# EAGLE schematic prototype_total_schematic_2355 (EAGLE 8.4.1)

## Sheet 1 of 2: Peripherals
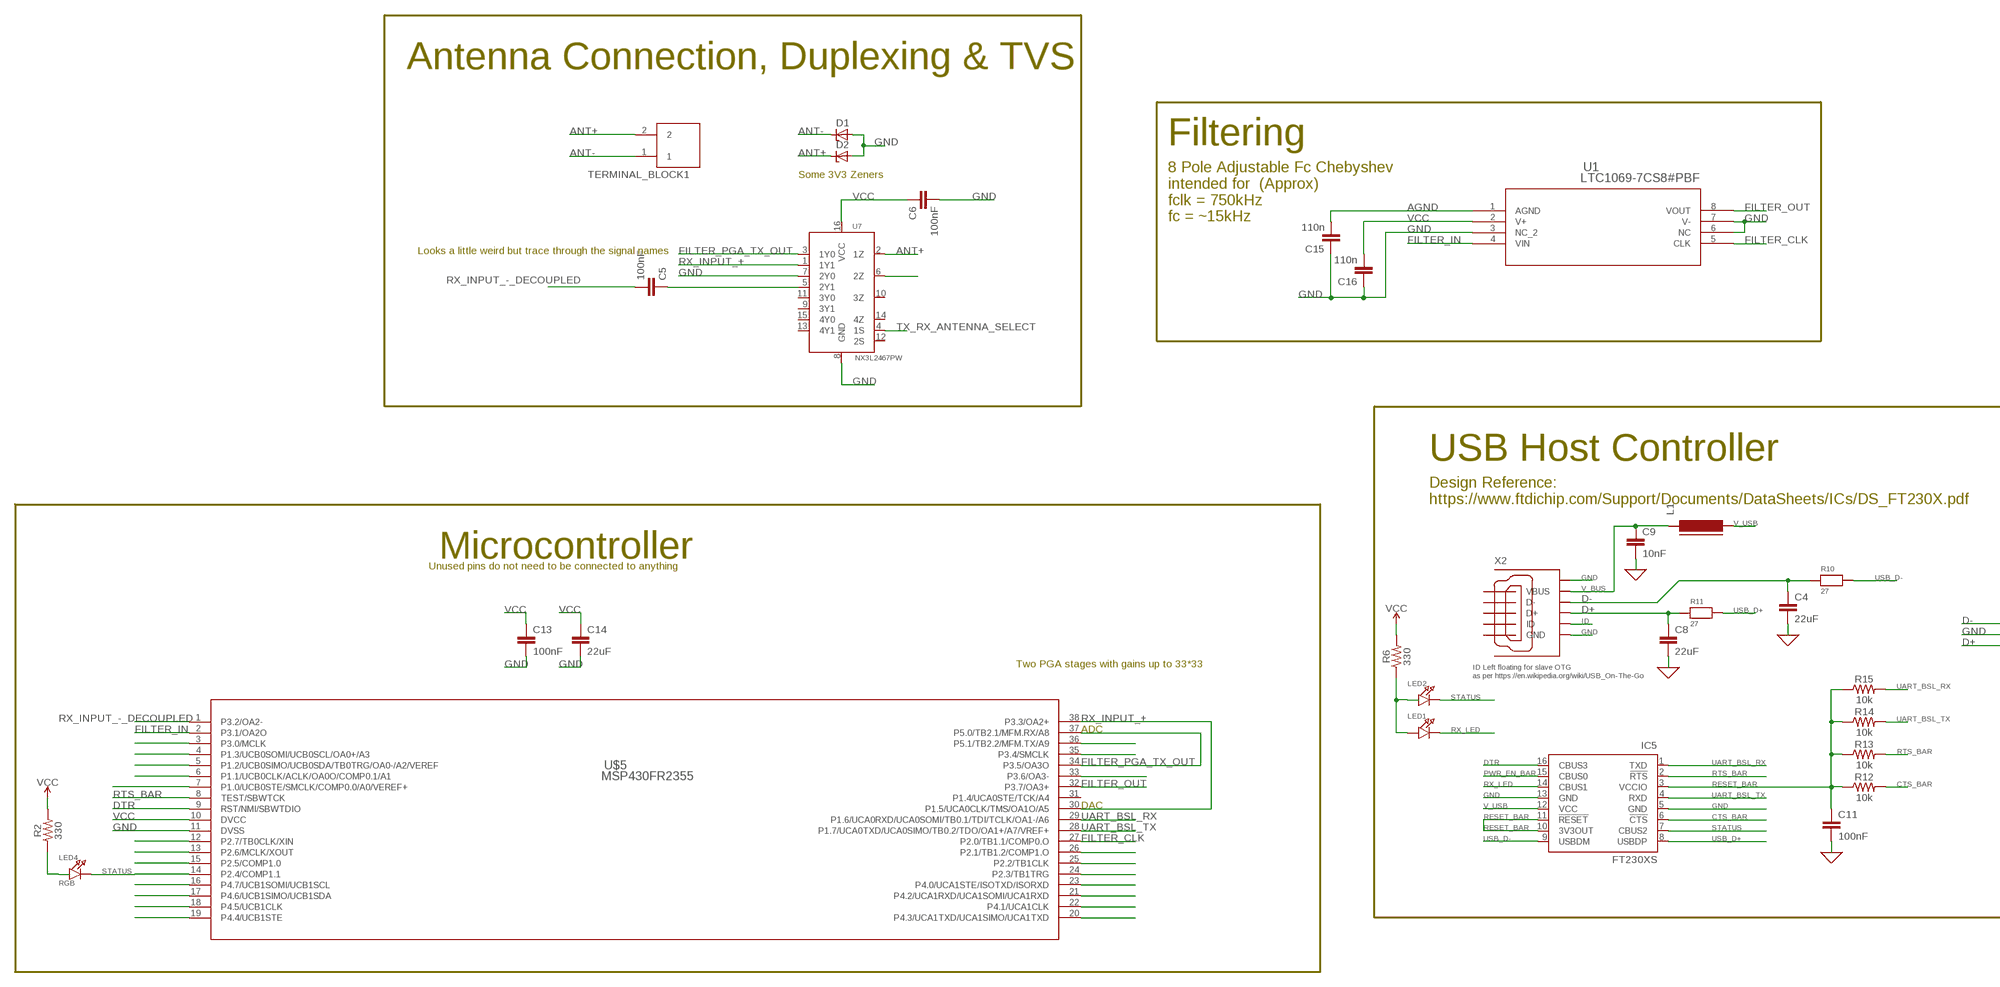
[diagram p0: schematic, sheet 1, part 1 of 2]
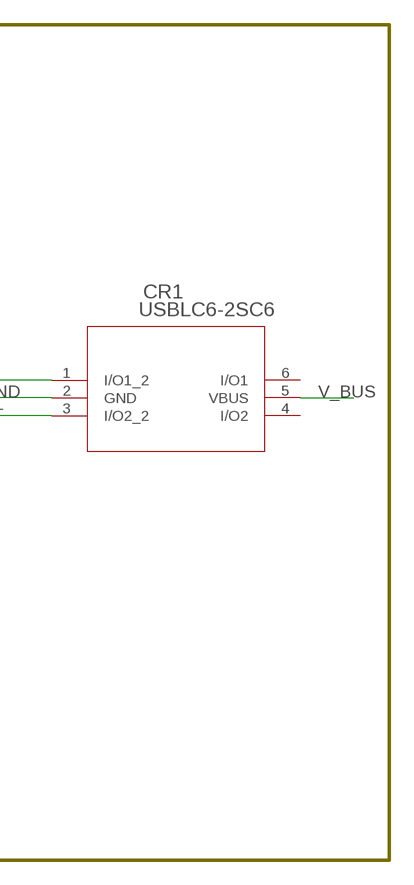
[diagram p1: schematic, sheet 1, part 2 of 2]

### Parts
C4  22uF  22UF-0805-6.3V-20%  [0805]
C5  100nF  22UF-0805-6.3V-20%  [0805]
C6  100nF  22UF-0805-6.3V-20%  [0805]
C8  22uF  22UF-0805-6.3V-20%  [0805]
C9  10nF  22UF-0805-6.3V-20%  [0805]
C11  100nF  22UF-0805-6.3V-20%  [0805]
C13  100nF  22UF-0805-6.3V-20%  [0805]
C14  22uF  22UF-0805-6.3V-20%  [0805]
C15  110n  22UF-0805-6.3V-20%  [0805]
C16  110n  22UF-0805-6.3V-20%  [0805]
CR1  USBLC6-2SC6  [SOT23-6L]
D1  ZENER-DIODESMB  [SMB]
D2  ZENER-DIODESMB  [SMB]
IC5  FT230XS  [SSOP16]
L1  FERRITE-0805  [FB805]
LED1  LED0805  [CHIPLED_0805]
LED2  LED0805  [CHIPLED_0805]
LED4  RGB  LED0805  [CHIPLED_0805]
R2  330  2.0KOHM-0603-1/10W-5%  [0603]
R6  330  2.0KOHM-0603-1/10W-5%  [0603]
R10  27  RESISTOR0805_NOTHERMALS  [0805_NOTHERMALS]
R11  27  RESISTOR0805_NOTHERMALS  [0805_NOTHERMALS]
R12  10k  2.0KOHM-0603-1/10W-5%  [0603]
R13  10k  2.0KOHM-0603-1/10W-5%  [0603]
R14  10k  2.0KOHM-0603-1/10W-5%  [0603]
R15  10k  2.0KOHM-0603-1/10W-5%  [0603]
TERMINAL_BLOCK1  ED555/2DS  [ED555/2DS]
U1  LTC1069-7CS8#PBF  [SO-8_S]
U7  NX3L2467PW  [SOT403-1]
U$5  MSP430FR2355  [DA38]
X2  GHI-CONNECTORS_10118192-0001LF  [GHI-CONNECTORS_10118192-0001LF(MICRO-USB-B-AMPHENOL-FCI)]

### Nets
0: C4.2 C8.2 C9.2 C11.2 ; supply symbol labelled GND
AGND: C15.2 U1.1(AGND)
ANT+: D2.C TERMINAL_BLOCK1.2 U7.6(2Z)
ANT-: D1.C TERMINAL_BLOCK1.1
CTS_BAR: IC5.6(!CTS) R12.2
D+: C8.1 CR1.3(I/O2_2) R11.1 X2.CGND3(SGND3)
D-: C4.1 CR1.1(I/O1_2) R10.1 X2.CGND4(SGND4)
DTR: IC5.16(CBUS3) U$5.9(RST/NMI/SBWTDIO)
FILTER_CLK: U1.5(CLK) U$5.27(P2.0/TB1.1/COMP0.O)
FILTER_IN: U1.4(VIN) U$5.2(P3.1/OA2O) ; also sheet 2
FILTER_OUT: U1.8(VOUT) U$5.32(P3.7/OA3+) ; also sheet 2
FILTER_PGA_TX_OUT: U7.3(1Y0) U$5.34(P3.5/OA3O) U$5.37(P5.0/TB2.1/MFM.RX/A8)
GND: C6.2 C13.2 C14.2 C15.1 C16.1 CR1.2(GND) D1.A D2.A IC5.5(GND) IC5.13(GND) U1.3(NC_2) U1.6(NC) U1.7(V-) U7.7(2Y0) U7.8(GND) U$5.11(DVSS) X2.CGND1(SGND1) X2.CGND6(SGND6) ; also sheet 2
ID: X2.CGND2(SGND2)
N$1: U$5.5(P1.2/UCB0SIMO/UCB0SDA/TB0TRG/OA0-/A2/VEREF)
N$2: U$5.20(P4.3/UCA1TXD/UCA1SIMO/UCA1TXD)
N$3: LED1.A LED2.A R6.1
N$4: LED4.A R2.1
N$5: C5.1 U7.5(2Y1)
N$6: U$5.22(P4.1/UCA1CLK)
N$8: U$5.21(P4.2/UCA1RXD/UCA1SOMI/UCA1RXD)
N$10: U$5.23(P4.0/UCA1STE/ISOTXD/ISORXD)
N$13: U$5.24(P2.3/TB1TRG)
N$14: U$5.25(P2.2/TB1CLK)
N$17: U$5.6(P1.1/UCB0CLK/ACLK/OA0O/COMP0.1/A1)
N$23: U$5.26(P2.1/TB1.2/COMP1.O)
N$32: U$5.35(P3.4/SMCLK)
N$33: U$5.36(P5.1/TB2.2/MFM.TX/A9)
N$38: U$5.3(P3.0/MCLK)
N$47: U$5.13(P2.6/MCLK/XOUT)
N$48: U$5.12(P2.7/TB0CLK/XIN)
N$49: U$5.14(P2.4/COMP1.1)
N$50: U$5.15(P2.5/COMP1.0)
N$51: U$5.16(P4.7/UCB1SOMI/UCB1SCL)
N$52: U$5.17(P4.6/UCB1SIMO/UCB1SDA)
N$53: U$5.18(P4.5/UCB1CLK)
N$54: U$5.19(P4.4/UCB1STE)
OA2+: U7.2(1Z)
OA3-: U$5.33(P3.6/OA3-)
PWR_EN_BAR: IC5.15(CBUS0)
RESET_BAR: C11.1 IC5.3(VCCIO) IC5.10(3V3OUT) IC5.11(!RESET) R12.1 R13.1 R14.1 R15.1
RTS_BAR: IC5.2(!RTS) R13.2 U$5.8(TEST/SBWTCK)
RX_INPUT_+: U7.1(1Y1) U$5.4(P1.3/UCB0SOMI/UCB0SCL/OA0+/A3) U$5.30(P1.5/UCA0CLK/TMS/OA1O/A5) U$5.38(P3.3/OA2+)
RX_INPUT_-_DECOUPLED: C5.2 U$5.1(P3.2/OA2-)
RX_LED: IC5.14(CBUS1) LED1.C
STATUS: IC5.7(CBUS2) LED2.C LED4.C
TX_RX_ANTENNA_SELECT: U7.4(1S)
UART_BSL_RX: IC5.1(TXD) R15.2 U$5.29(P1.6/UCA0RXD/UCA0SOMI/TB0.1/TDI/TCLK/OA1-/A6)
UART_BSL_TX: IC5.4(RXD) R14.2 U$5.28(P1.7/UCA0TXD/UCA0SIMO/TB0.2/TDO/OA1+/A7/VREF+)
USB_D+: IC5.8(USBDP) R11.2
USB_D-: IC5.9(USBDM) R10.2
V_BUS: C9.1 CR1.5(VBUS) L1.1 X2.CGND5(SGND5)
V_CM: U$5.7(P1.0/UCB0STE/SMCLK/COMP0.0/A0/VEREF+)
V_USB: IC5.12(VCC) L1.2
VCC: C6.1 C13.1 C14.1 C16.2 R2.2 R6.2 U1.2(V+) U7.16(VCC) U$5.10(DVCC) ; also sheet 2
Unconnected: CR1.4(I/O2) CR1.6(I/O1) U7.9(3Y1) U7.10(3Z) U7.11(3Y0) U7.12(2S) U7.13(4Y1) U7.14(4Z) U7.15(4Y0) U$5.31(P1.4/UCA0STE/TCK/A4) X2.D+ X2.D- X2.GND X2.ID X2.VBUS

### Notes on the sheet
- Antenna Connection, Duplexing & TVS
- Filtering
- Some 3V3 Zeners
- 8 Pole Adjustable Fc Chebyshev
  intended for  (Approx)
  fclk = 750kHz 
  fc = ~15kHz
- Looks a little weird but trace through the signal names
- USB Host Controller
- Design Reference:
  https://www.ftdichip.com/Support/Documents/DataSheets/ICs/DS_FT230X.pdf
- Microcontroller
- Unused pins do not need to be connected to anything
- Two PGA stages with gains up to 33*33
- ID Left floating for slave OTG
  as per https://en.wikipedia.org/wiki/USB_On-The-Go
- ADC
- DAC

## Sheet 2 of 2
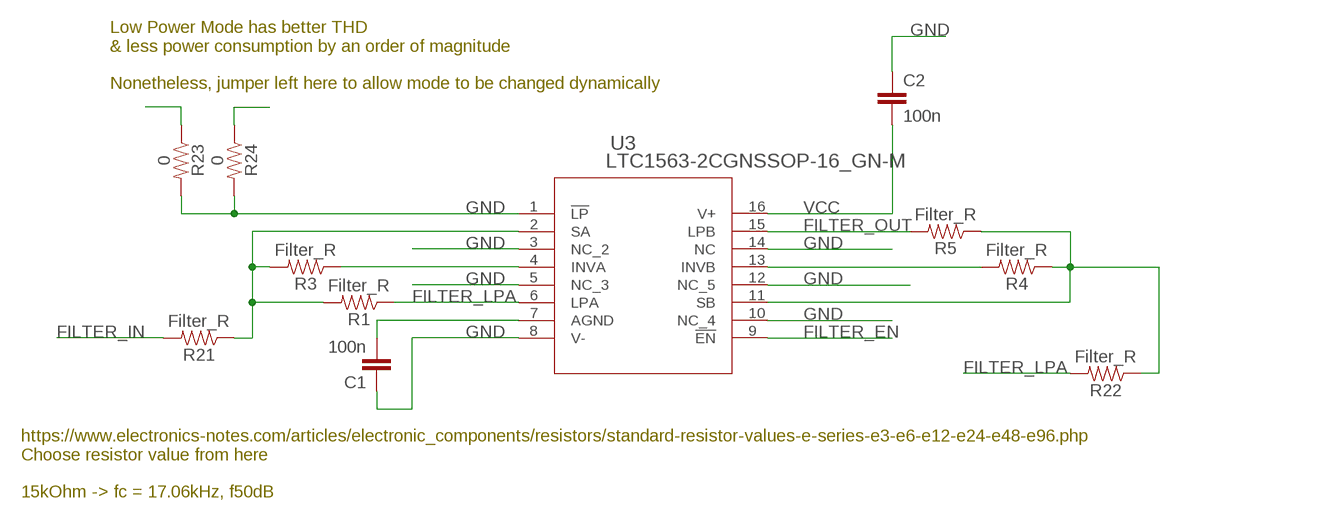
[diagram p2: schematic, sheet 2]

### Parts
C1  100n  22UF-0805-6.3V-20%  [0805]
C2  100n  22UF-0805-6.3V-20%  [0805]
R1  Filter_R  2.0KOHM-0603-1/10W-5%  [0603]
R3  Filter_R  2.0KOHM-0603-1/10W-5%  [0603]
R4  Filter_R  2.0KOHM-0603-1/10W-5%  [0603]
R5  Filter_R  2.0KOHM-0603-1/10W-5%  [0603]
R21  Filter_R  2.0KOHM-0603-1/10W-5%  [0603]
R22  Filter_R  2.0KOHM-0603-1/10W-5%  [0603]
R23  0  2.0KOHM-0603-1/10W-5%  [0603]
R24  0  2.0KOHM-0603-1/10W-5%  [0603]
U3  LTC1563-2CGNSSOP-16_GN-M  [SSOP-16_GN-M]

### Nets
FILTER_EN: U3.9(!EN)
FILTER_IN: R21.2 ; also sheet 1
FILTER_INVB1: R4.2 U3.13(INVB)
FILTER_LPA: R1.1 R22.2 U3.6(LPA)
FILTER_OUT: R5.2 U3.15(LPB) ; also sheet 1
FILTER_SB1: R4.1 R5.1 R22.1 U3.11(SB)
GND: C1.1 C2.1 R23.2 R24.1 R24.2 U3.1(!LP) U3.3(NC_2) U3.5(NC_3) U3.8(V-) U3.10(NC_4) U3.12(NC_5) U3.14(NC) ; also sheet 1
N$7: R1.2 R3.2 R21.1 U3.2(SA)
N$9: R3.1 U3.4(INVA)
N$12: C1.2 U3.7(AGND)
VCC: C2.2 R23.1 U3.16(V+) ; also sheet 1

### Notes on the sheet
- Low Power Mode has better THD
  & less power consumption by an order of magnitude
  
  Nonetheless, jumper left here to allow mode to be changed dynamically
- https://www.electronics-notes.com/articles/electronic_components/resistors/standard-resistor-values-e-series-e3-e6-e12-e24-e48-e96.php
  Choose resistor value from here
  
  15kOhm -> fc = 17.06kHz, f50dB

## Library data of the parts
C1 C2 C5 C6 C9 C11 C13 C15 C16 = SparkFun-Capacitors:22UF: 22µF ceramic capacitors A capacitor is a passive two-terminal electrical component used to store electrical energy temporarily in an electric field.; PROD_ID: CAP-08402; VALUE: 22uF
C4 C8 C14 = SparkFun-Capacitors:22UF: 22µF ceramic capacitors A capacitor is a passive two-terminal electrical component used to store electrical energy temporarily in an electric field.; PROD_ID: CAP-08402
CR1 = TTE:USBLC6-2SC6; MANUFACTURER_PART_NUMBER: USBLC62SC6; VENDOR: STMicroelectronics
D1 D2 = diode:ZENER-DIODE: Z-Diode
IC5 = ftdi:FT230X: USB to BASIC UART IC Auto generated by make-symbol-device-package-bsdl.ulp Rev. 43 Source: Data sheet <http://www.ftdichip.com/Support/Documents/DataSheets/ICs/DS_FT230X.pdf>
L1 = dp_devices:FERRITE: Ferrite bead in various packages
LED1 LED2 LED4 = microbuilder:LED: LED 0603 - 0603 Surface Mount Package 2mA: Green LED - Low Power (3.9mcd, 2ma, 1.7Vf) - Digikey: 475-2709-2-ND Orange LED - Low Power (9.8mcd, 2ma, 1.8Vf) - Digikey: 475-1194-2-ND Red LED - Low Power (5mcd, 2ma, 1.8Vf) - Digikey: 475-1195-2-ND Yellow LED - Low Power (7mcd, 2ma, 1.8Vf) - Digikey: 475-1196-2-ND 5mA: Blue LED - Low Power (17mcd, 5ma, 2.9Vf) - Digikey: LNJ937W8CRACT-ND 0805 - 0805 Surface Mount Package 2mA: Red LED (8.8mcd, 2mA, 1.8Vf, Clear) - Low Power [Digikey: 475-2510-1-ND] Green LED (5mcd, 2mA, 1.8Vf, Clear) - Low Power [Digikey: 475-2730-1-ND] Yellow LED (11.3mcd, 2mA, 1.8Vf, Clear) - Low Power [Digikey: 475-2555-1-ND] 20mA: Red LED (104mcd, 20mA, Diffused) - LS R976 [Digikey: 475-1278-6-ND] Red LED (12mcd, 20mA, 2.0Vf, Clear) - APT2012EC [Digikey: 754-1128-1-ND] Green LED (15mcd, 20mA, 2.2Vf, Clear) - APT2012GC [Digikey: 754-1131-1-ND] Orange LED (160mcd, 20mA, 2.1Vf, Clear) - APT2012SECK [Digikey: 754-1130-1-ND] 1206 - 1206 Surface Mount Package Green LED (26mcd, 20mA, Diffused) - LG N971 [Digikey: 475-1407-6-ND] Red LED (15mcd, 20mA, Diffused) - LH N974 [Digikey: 475-1416-6-ND]
R1-R6 R12-R15 R21-R24 = SparkFun-Resistors:2.0KOHM: 2kΩ resistor A resistor is a passive two-terminal electrical component that implements electrical resistance as a circuit element. Resistors act to reduce current flow, and, at the same time, act to lower voltage levels within circuits. - Wikipedia; PROD_ID: RES-08296; VALUE: 2.0k
R10 R11 = microbuilder:RESISTOR: Resistors 0402 - 0402 Surface Mount Package 22 Ohm 1% 1/16W [Digikey: 311-22.0LRTR-ND] 33 Ohm 5% 1/16W 1.0K 5% 1/16W 1.5K 5% 1/16W 2.0K 1% 1/16W 10.0K 1% 1/16W [Digikey: 311-10.0KLRTR-ND] 10.0K 5% 1/16W [Digikey: RMCF0402JT10K0TR-ND] 12.1K 1% 1/16W [Digikey: 311-22.0LRTR-ND] 100.0K 5% 1/16W 0603 - 0603 Surface Mount Package 0 Ohm 1/10 Watt 1% Resistor 15 Ohm 1/10 Watt 1% Resistor 33 Ohm 1/10 Watt 1% Resistor 49.9 Ohm 1/10 Watt 1% Resistor 100 Ohm 1/10 Watt 1% Resistor 150 Ohm 1/10 Watt 1% Resistor 240 Ohm 1/10 Watt 1% Resistor 390 Ohm 1/10 Watt 1% Resistor 560 Ohm 1/10 Watt 1% Resistor 680 Ohm 1/10 Watt 1% Resistor 750 Ohm 1/10 Watt 1% Resistor 1.0K Ohm 1/10 Watt 1% Resistor 1.5K Ohm 1/10 Watt 1% Resistor 2.0K Ohm 1/10 Watt 1% Resistor 2.2K Ohm 1/10 Watt 1% Resistor 3.3K Ohm 1/10 Watt 1% Resistor 4.7K Ohm 1/10 Watt 1% Resistor 10.0K Ohm 1/10 Watt 1% Resistor 12.0K Ohm 1/10 Watt 1% Resistor 12.1K Ohm 1/10 Watt 1% Resistor 20.0K Ohm 1/10 Watt 1% Resistor 33.0K Ohm 1/10 Watt 1% Resistor 100.0K Ohm 1/10 Watt 1% Resistor 0805 - 0805 Surface Mount Package 0 Ohm 1/8 Watt 1% Resistor 33 Ohm 1/8 Watt 1% Resistor 100 Ohm 1/8 Watt 1% Resistor 150 Ohm 1/8 Watt 1% Resistor 200 Ohm 1/8 Watt 1% Resistor 240 Ohm 1/8 Watt 1% Resistor 330 Ohm 1/8 Watt 1% Resistor 390 Ohm 1/8 Watt 1% Resistor 470 Ohm 1/8 Watt 1% Resistor 1.0K Ohm 1/8 Watt 1% Resistor 1.5K Ohm 1/8 Watt 1% Resistor 2.0K Ohm 1/8 Watt 1% Resistor 4.7K Ohm 1/8 Watt 1% Resistor 5.1K Ohm 1/8 Watt 1% Resistor 5.6K Ohm 1/8 Watt 1% Resistor 10.0K Ohm 1/8 Watt 1% Resistor 22.0K Ohm 1/8 Watt 1% Resistor 33.0K Ohm 1/8 Watt 1% Resistor 100K Ohm 1/8 Watt 1% Resistor 1206 - 1206 Surface Mount Package 2012 - 2010 Surface Mount Package 0.11 Ohm 1/2 Watt 1% Resistor - Digikey: RHM.11UCT-ND
TERMINAL_BLOCK1 = DC_LOAD_AU:ED555/2DS: 2-Pin Terminal Block 3.5mm pitch 6A
U1 = TTE:LTC1069-7CS8#PBF; DESCRIPTION: LTC1069-7 - Linear Phase 8th Order Lowpass Filter; DIGI-KEY_PART_NUMBER: LTC1069-7CS8#PBF-ND; DIGI-KEY_PURCHASE_URL: https://www.digikey.com/product-detail/en/linear-technology-analog-devices/LTC1069-7CS8-PBF/LTC1069-7CS8-PBF-ND/889060?utm_source=snapeda&utm_medium=aggregator&utm_campaign=symbol; MF: Linear Technology; MP: LTC1069-7CS8#PBF; PACKAGE: SOIC-8 Linear Technology
U3 = TTE:LTC1563-2CGN; MANUFACTURER_PART_NUMBER: LTC15632CGN; VENDOR: Linear Technology
U7 = TTE:NX3L2467: The NX3L2467 is a dual low-ohmic double-pole double-throw analog switch suitable for use as an analog or digital multiplexer/demultiplexer. It consists of four switches, each with two independent input/outputs (nY0 and nY1) and a common input/output (nZ). The two digital inputs (1S and 2S) are used to select the switch position. 1S is used in selecting the independent inputs/outputs switched to 1Z and 2Z, and 2S is used in selecting the independent inputs/outputs switched to 3Z and 4Z. Schmitt trigger action at the select input (nS) makes the circuit tolerant to slower input rise and fall times across the entire VCC range from 1.4 V to 4.3 V. AAL Eindhoven MK
U$5 = TTE:MSP430FR2355
X2 = BeagleBone_Black_Wireless:GHI-CONNECTORS_10118192-0001LF: Amphenol FCI Micro USB Type B Complete Surface Mount (SMT) no guide holes